# Altium schematic sheet MC33035.SchDoc
size A; SheetNumber: 1; SheetTotal: 1
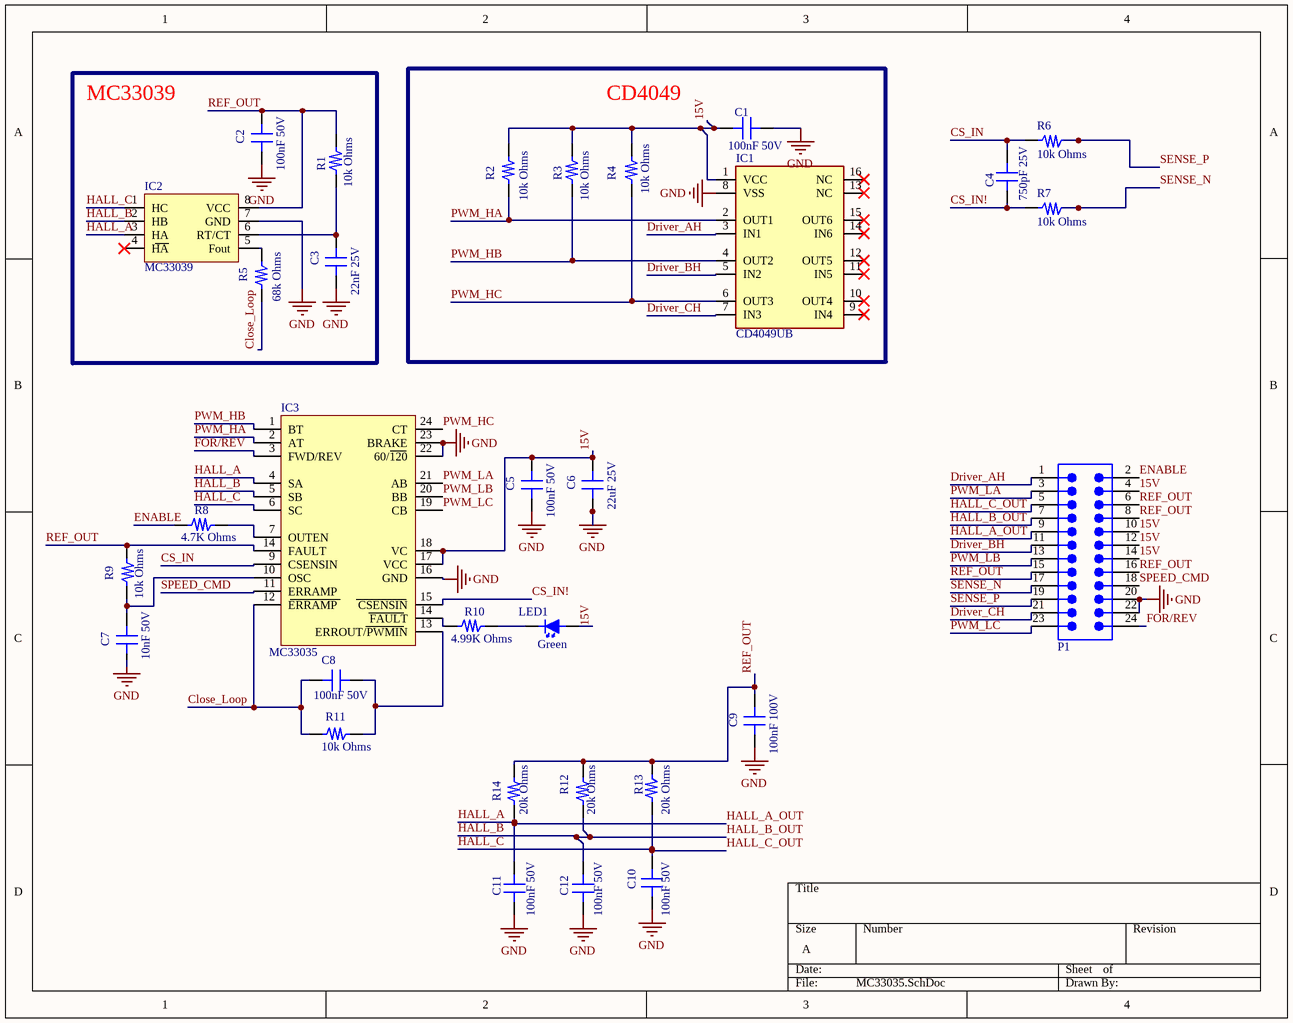
[diagram p0: MC33035.SchDoc]

## Parts
C1  100nF 50V  [0805_CAP]
C2  100nF 50V  [0805_CAP]
C3  22nF 25V  [0805_CAP]
C4  750pF 25V  [0805_CAP]
C5  100nF 50V  [0805_CAP]
C6  22uF 25V  [0805_CAP]
C7  10nF 50V  [0805_CAP]
C8  100nF 50V  [0805_CAP]
C9  100nF 100V  [0805_CAP]
C10  100nF 50V  [0805_CAP]
C11  100nF 50V  [0805_CAP]
C12  100nF 50V  [0805_CAP]
IC1  CD4049UB  [SOIC16]
IC2  MC33039  [SOIC8]
IC3  MC33035  [SOIC-24 WB]
LED1  Green  [0805LED]
P1  61302421121  [61302421121]  (value not drawn)
R1  10k Ohms  [0805_RES]
R2  10k Ohms  [0805_RES]
R3  10k Ohms  [0805_RES]
R4  10k Ohms  [0805_RES]
R5  68k Ohms  [0805_RES]
R6  10k Ohms  [0805_RES]
R7  10k Ohms  [0805_RES]
R8  4.7K Ohms  [0805_RES]
R9  10k Ohms  [0805_RES]
R10  4.99K Ohms  [0805_RES]
R11  10k Ohms  [0805_RES]
R12  20k Ohms  [0805_RES]
R13  20k Ohms  [0805_RES]
R14  20k Ohms  [0805_RES]

## Nets
GND: C1.2 C2.1 C3.1 C5.1 C6.1 C7.1 C9.1 C10.1 C11.1 C12.1 IC1.8(VSS) IC2.7(GND) IC3.16(GND) IC3.22(60/120) IC3.23(BRAKE) P1.20 P1.22
15V: C1.1 C5.2 C6.2 IC1.1(VCC) IC3.17(VCC) IC3.18(VC) LED1.1(Anode(+)) P1.4 P1.10 P1.12 P1.14 R2.2 R3.2 R4.2
Close_Loop: C8.1 IC3.12(ERRAMP) R5.1 R11.1
CS_IN: C4.2 IC3.9(CSENSIN) R6.2
CS_IN!: C4.1 IC3.15(CSENSIN) R7.2
Driver_AH: IC1.3(IN1) P1.1
Driver_BH: IC1.5(IN2) P1.11
Driver_CH: IC1.7(IN3) P1.21
ENABLE: P1.2 R8.1
FOR/REV: IC3.3(FWD/REV) P1.24
HALL_A: C11.2 IC2.3(HA) IC3.4(SA) P1.9 R14.1  [also labelled HALL_A_OUT]
HALL_B: C12.2 IC2.2(HB) IC3.5(SB) P1.7 R12.1  [also labelled HALL_B_OUT]
HALL_C: C10.2 IC2.1(HC) IC3.6(SC) P1.5 R13.1  [also labelled HALL_C_OUT]
PWM_HA: IC1.2(OUT1) IC3.2(AT) R2.1
PWM_HB: IC1.4(OUT2) IC3.1(BT) R3.1
PWM_HC: IC1.6(OUT3) IC3.24(CT) R4.1
PWM_LA: IC3.21(AB) P1.3
PWM_LB: IC3.20(BB) P1.13
PWM_LC: IC3.19(CB) P1.23
REF_OUT: C2.2 C9.2 IC2.8(VCC) IC3.14(FAULT) P1.6 P1.8 P1.15 P1.16 R1.2 R9.1 R12.2 R13.2 R14.2
SENSE_N: P1.17 R7.1
SENSE_P: P1.19 R6.1
SPEED_CMD: IC3.11(ERRAMP) P1.18
NetC3_2: C3.2 IC2.6(RT/CT) R1.1
NetC7_2: C7.2 IC3.10(OSC) R9.2
NetC8_2: C8.2 IC3.13(ERROUT/PWMIN) R11.2
NetIC2_5: IC2.5(Fout) R5.2
NetIC3_7: IC3.7(OUTEN) R8.2
NetIC3_14: IC3.14(FAULT) R10.1
NetLED1_2: LED1.2(Cathode(-)) R10.2

Not connected (* = marked no-connect by the designer): IC1 9(IN4)* 10(OUT4)* 11(IN5)* 12(OUT5)* 13(NC)* 14(IN6)* 15(OUT6)* 16(NC)*; IC2 4(HA)*

## Notes on the sheet
- MC33039
- CD4049

## Library data of the parts
C1-C12 = CAP_0805
  C1 C2 C5 C8 C10-C12: Value: 100nF 50V
  C3: Value: 22nF 25V
  C4: Value: 750pF 25V
  C6: Value: 22uF 25V
  C7: Value: 10nF 50V
  C9: Value: 100nF 100V
IC1 = CD4049UB: CMOS Hex Inverting Buffer and Converter; PartNumber: CD4049UB
IC2 = MC33039: Closed Loop Brushless / Motor Adapter; ComponentLink1Description: Datasheet; ComponentLink1URL: https://www.onsemi.com/pdf/datasheet/mc33039-d.pdf; PartNumber: MC33039
IC3 = MC33035: Brushless DC Motor Controller; ComponentLink1Description: New link; ComponentLink1URL: https://www.onsemi.com/pdf/datasheet/mc33035-d.pdf; PartNumber: MC33035
LED1 = LED: FAULT
P1 = 61302421121: WR-PHD Pin Header, THT, Vertical, pitch 2.54mm, 2 Row, 24P; Manufacturer: Wurth Elektronik; Contact Resistance: 20mOhm; Rated Current: 3A; Working Voltage: 250V; Withstanding Voltage: 500V; Manufacturer Part Number: 61302421121; Category: Board-to-Board Connectors; Match Code: WR-PHD; ComponentLink1Description: Website Link; ComponentLink1URL: https://www.we-online.com/redexpert/article/61302421121?ad; ComponentLink2Description: Datasheet Link; ComponentLink2URL: https://www.we-online.com/redexpert/spec/61302421121?ad; Mount: Through Hole; Operating Temperature Max: 105°C; Operating Temperature Min: -40°C; Packaging: Bag; Gender: Pin Header; Number of Pins: 24; Number of Rows: 2; Orientation: Vertical; Pitch: 2.54mm
R1-R14 = RES_0805: 0805; Power: 1/8 W
  R1-R4 R6 R7 R9 R11: Value: 10k Ohms
  R5: Value: 68k Ohms
  R8: Value: 4.7K Ohms
  R10: Value: 4.99K Ohms
  R12-R14: Value: 20k Ohms